# Altium schematic sheet CHARGER.SchDoc
size A4; SheetNumber: 3; SheetTotal: 4
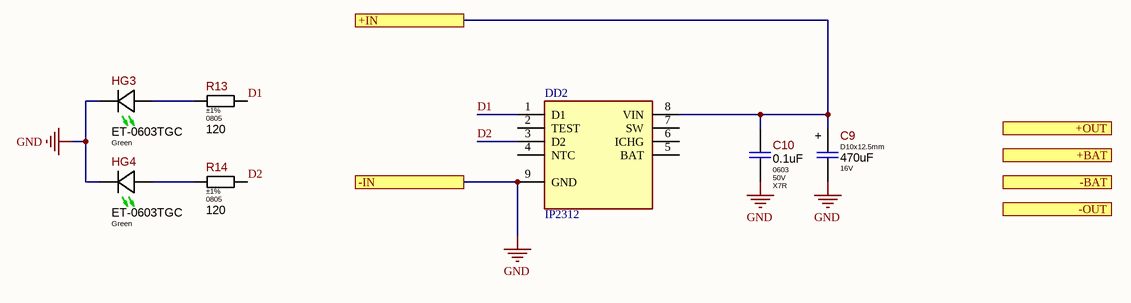
[diagram p0: CHARGER.SchDoc]

## Parts
C9  value 470uF  Package: D10x12.5mm  Voltage: 16V  [CAP-AE-PTH-100D10x125H15]  (hidden comment: 470uFx16V)
C10  Package: 0603  Voltage: 50V  Dielectric Type: X7R  [C_CERAMIC_0603_MED]  (hidden comment: 0.1uF)
DD2  IP2312  [IP2313]
HG3  Color: Green  [ET-0603]  (hidden comment: ET-0603TGC)
HG4  Color: Green  [ET-0603]  (hidden comment: ET-0603TGC)
R13  Tolerance: ±1%  Package: 0805  [R_ANY_CHIP_0805_MED]  (hidden comment: 120)
R14  Tolerance: ±1%  Package: 0805  [R_ANY_CHIP_0805_MED]  (hidden comment: 120)

## Ports
+BAT, +IN, +OUT, -BAT, -IN, -OUT

## Nets
GND: C9.2 C10.2 DD2.9(GND) HG3.CA(Cathode) HG4.CA(Cathode) ; port -IN
+IN: C9.1 C10.1 DD2.8(VIN) ; port +IN
D1: DD2.1(D1) R13.2
D2: DD2.3(D2) R14.2
NetHG3_AN: HG3.AN(Anode) R13.1
NetHG4_AN: HG4.AN(Anode) R14.1

Not connected (* = marked no-connect by the designer): DD2 2(TEST) 4(NTC) 5(BAT) 6(ICHG) 7(SW)

## Notes on the sheet
- (in symbol EXR471M16B) +

## Library data of the parts
C9 = EXR471M16B: 470uF 16V D10x12.5mm Electrolytic Low Impedance; Manufacturer: Hitano; Ajax_1C_ID: 15747; Ajax_1C_PN: 470uF 16V 10x12.5mm EXR EXR471M16B-Hitano pcs; Ajax_1С_Status: Mass Production; Standard Lead Time: NONE; Component Status: Released; Tolerance: ±20%; GUID_1C: 3364ee07-6280-11e9-ab4f-0050569f2651; Part Number: EXR471M16B; Part Type: Aluminum; Component Type: PTH; Temperature Range: -40°C ~ 105°C; Dielectric Type: NONE; ComponentLink1URL: https://www.hitano.com.tw/wp-content/uploads/doc/EXR_20200408.pdf; Replacement: NONE; Price: 0,045; ComponentLink1Description: Datasheet
C10 = CL10B104KB8NNND: 100nF 50V X7R ±10% 0603 Ceramic Capacitor RoHS; Manufacturer: Samsung Electro-Mechanics; Ajax_1C_ID: 21313; Ajax_1C_PN: 100nF 50V X7R 10% 0603 CL10B104KB8NNND ceramic capacitor SMD; Ajax_1С_Status: Substitution; Standard Lead Time: 18 Weeks; Component Status: Released; Replacement: CL10B104KB8NNNC; GUID_1C: f1fd6399-ca68-11ea-ab63-0050569f2651; Value: 0.1uF; Part Number: CL10B104KB8NNND; Part Type: Ceramic / X7R / 0603; Component Type: SMD; Temperature Range: -55°C ~ 125°C; Tolerance: ±10%; ComponentLink1URL: https://media.digikey.com/pdf/Data%20Sheets/Samsung%20PDFs/CL_Series_MLCC_ds.pdf; Supplier 1: Digi-Key; Supplier Part Number 1: CL10B104KB8NNND-ND; Price: 0,0039378; ComponentLink1Description: Datasheet
HG3 HG4 = ET-0603TGC: Low Power LED, Green 525nm, SMD 0603, Vf 2.35V, 28.5 ~ 72mcd @ 20 mA, 120°; Manufacturer: Everlight Electronics; Ajax_1C_ID: 5036; Ajax_1C_PN: ET-0603TGC Green SMD LED 0603 EVERLIGHT RoHS pcs; Ajax_1С_Status: Substitution; Component Status: Released; Replacement: NONE; GUID_1C: c5736a6f-2a0e-11e4-b679-a45d36c4a9e5; Part Number: ET-0603TGC; Lifecycle: Not Recommended; Part Type: LED / 0603; Component Type: SMD; Package: 0603; Wavelength: 525nm; Temperature Range: -40°C ~ 85°C; ComponentLink1URL: https://www.everlight.com/file/ProductFile/DSE-0007527-19-217-GHC-YN1P2B18X-3T-V5.pdf; Price: 0,06836462; ComponentLink1Description: Datasheet
R13 R14 = RC0805FR-07120RL: 120 Ohms ±1%, 1/8W 0805 Thick Film Resistor; Manufacturer: Yageo; Ajax_1C_ID: 14156; Ajax_1C_PN: 120R 1% 0805 Resistors SMD RoHS; Ajax_1С_Status: Mass Production; Power Rating: 0.125W; Voltage: 150V; Component Status: Released; Temperature Stability: ±100ppm/°C; Replacement: NONE; GUID_1C: b31bb40e-dc54-11e8-ab4a-0050569f2651; Value: 120; Part Number: RC0805FR-07120RL; Component Type: SMD; Part Type: Thick Film; Temperature Range: -55°C ~ 155°C; ComponentLink1URL: https://eu.mouser.com/datasheet/2/447/PYu_RC_Group_51_RoHS_L_10-1664068.pdf; Price: 0,0014; ComponentLink1Description: Datasheet